# Altium schematic sheet CON_USER_20WBOXHDRRAMx2.SCHDOC: 36-Way User I/O Headers
size A4; Organization: Altium Limited.; Address1: Level 3, 12a Rodborough Rd; Address2: Frenchs Forest 2086; Address3: NSW; Address4: AUSTRALIA; Revision: 6; SheetNumber: 46; SheetTotal: 64
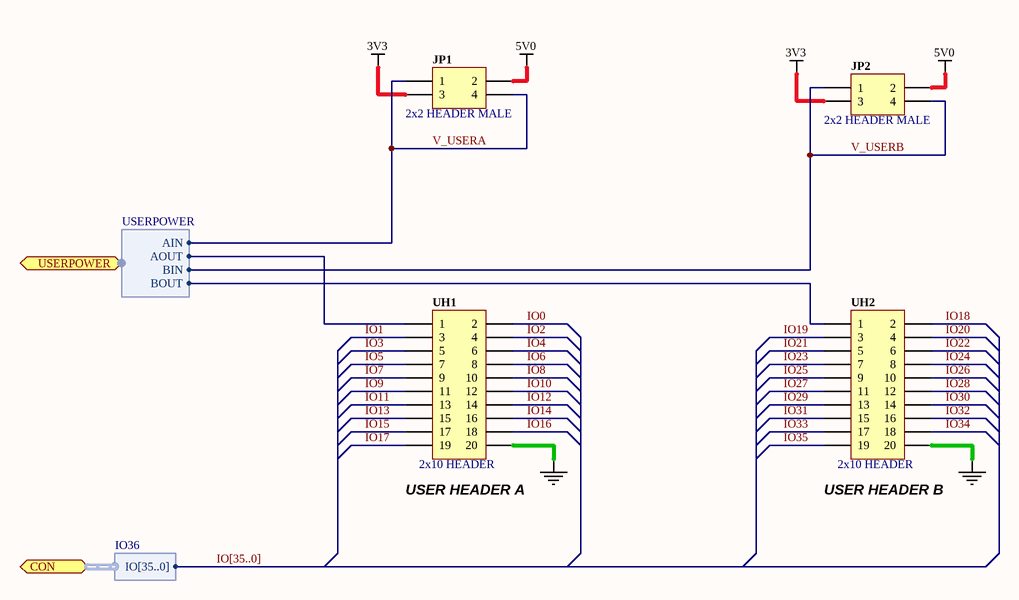
[diagram p0: CON_USER_20WBOXHDRRAMx2.SCHDOC]

## Parts
JP1  2x2 HEADER MALE  [HDR2X2]
JP2  2x2 HEADER MALE  [HDR2X2]
UH1  2x10 HEADER  [HDR2X10]
UH2  2x10 HEADER  [HDR2X10]

## Ports
CON (harness IO36), USERPOWER (harness USERPOWER)

## Harnesses
IO36: IO[35..0]
USERPOWER: AIN, BIN, AOUT, BOUT

## Nets
3V3: JP1.3 JP2.3
5V0: JP1.2 JP2.2
GND: UH1.20 UH2.20
IO0: UH1.2
IO1: UH1.3
IO2: UH1.4
IO3: UH1.5
IO4: UH1.6
IO5: UH1.7
IO6: UH1.8
IO7: UH1.9
IO8: UH1.10
IO9: UH1.11
IO10: UH1.12
IO11: UH1.13
IO12: UH1.14
IO13: UH1.15
IO14: UH1.16
IO15: UH1.17
IO16: UH1.18
IO17: UH1.19
IO18: UH2.2
IO19: UH2.3
IO20: UH2.4
IO21: UH2.5
IO22: UH2.6
IO23: UH2.7
IO24: UH2.8
IO25: UH2.9
IO26: UH2.10
IO27: UH2.11
IO28: UH2.12
IO29: UH2.13
IO30: UH2.14
IO31: UH2.15
IO32: UH2.16
IO33: UH2.17
IO34: UH2.18
IO35: UH2.19
V_USERA: JP1.1 JP1.4 ; port USERPOWER.AIN
V_USERB: JP2.1 JP2.4 ; port USERPOWER.BIN
NetUH1_1: UH1.1 ; port USERPOWER.AOUT
NetUH2_1: UH2.1 ; port USERPOWER.BOUT

## Buses and harness runs
bus IO[35..0]

## Notes on the sheet
- (near UH1) USER HEADER A
- (near UH2) USER HEADER B
- Sheet Title
- Project Title
- Size:
- Date:
- A4
- Assy:
- Time:
- Sheet
- Revision:
- of
- File:

## Library data of the parts
JP1 JP2 = D-300-0019: Header IDC, 2 x 2 Pin Vertical 2.54mm Pitch (Non-Boxed, Male); Max Current: 3 A; Category: Connector; Connector type: Header; Mounting Technology: Through-Hole; Pin Count: 4; Status: Production
UH1 UH2 = D-300-0021: Header IDC, 2 x 10 Pin Vertical 2.54mm Pitch (Non-Boxed, Male); Max Current: 3 A; Category: Connector; Connector type: Header; Mounting Technology: Through-Hole; Pin Count: 20; Status: Production